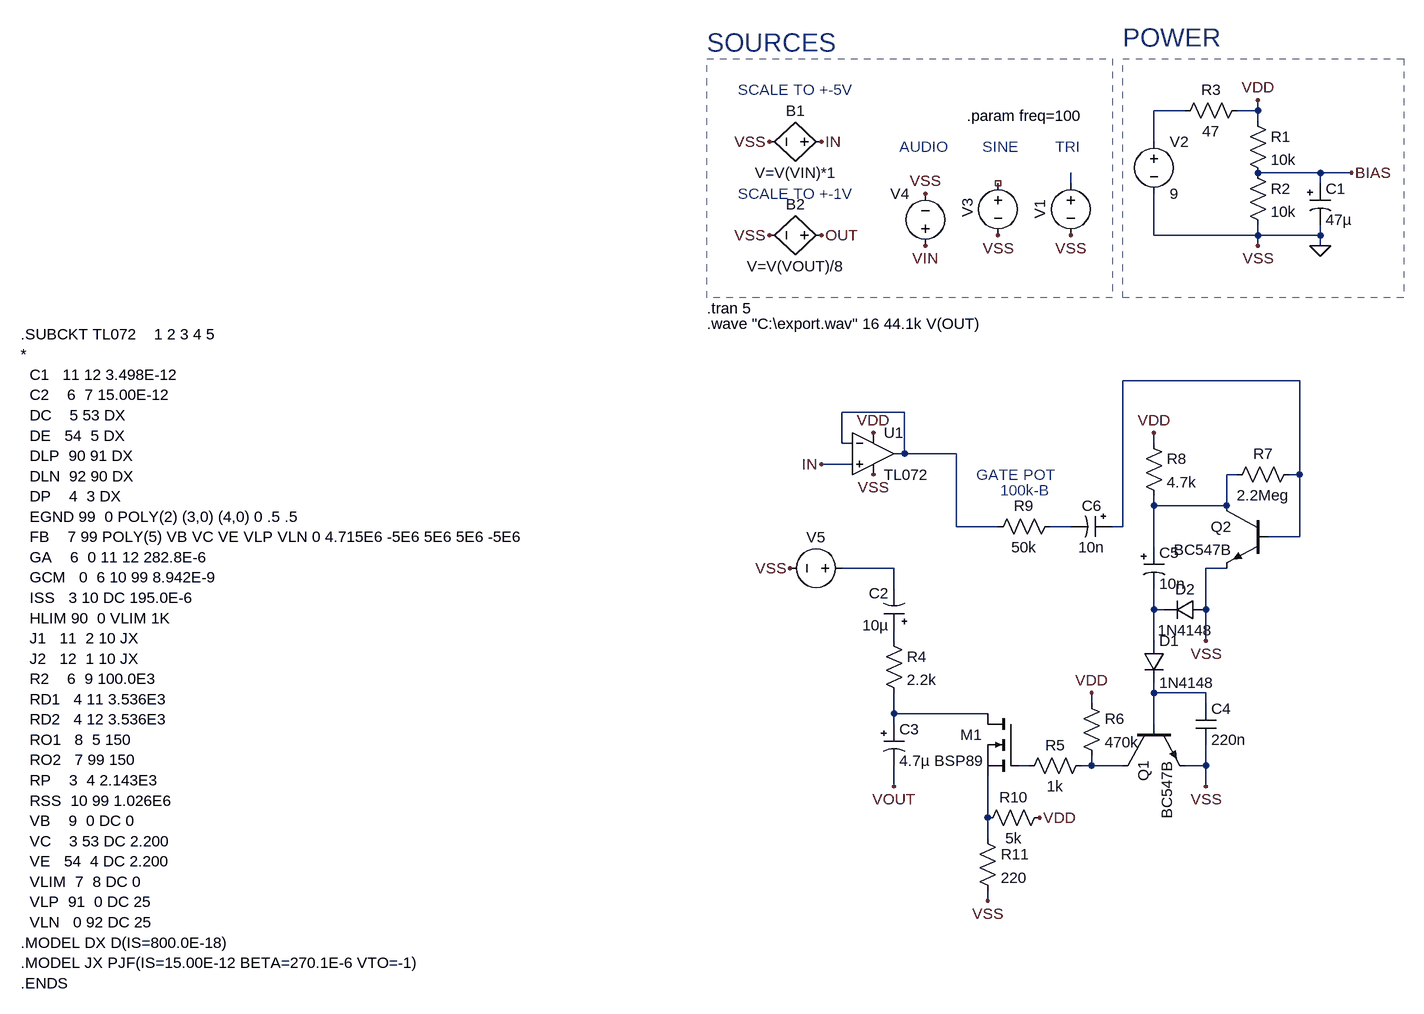
[diagram p0: schematic gate.asc]
gate.asc, the LTspice schematic file:
Version 4
SHEET 1 880 1276
WIRE 528 -32 480 -32
WIRE 640 -32 640 -48
WIRE 640 -32 608 -32
WIRE 640 -16 640 -32
WIRE 480 16 480 -32
WIRE 736 64 640 64
WIRE 784 64 736 64
WIRE 352 80 352 64
WIRE 736 80 736 64
WIRE 480 160 480 96
WIRE 640 160 640 144
WIRE 640 160 480 160
WIRE 736 160 736 144
WIRE 736 160 640 160
WIRE 640 176 640 160
WIRE 736 176 736 160
WIRE 704 384 432 384
WIRE 96 432 0 432
WIRE 0 480 0 432
WIRE 16 480 0 480
WIRE 480 480 480 464
WIRE 96 496 96 432
WIRE 96 496 80 496
WIRE 176 496 96 496
WIRE 16 512 -32 512
WIRE 608 528 592 528
WIRE 704 528 704 384
WIRE 704 528 688 528
WIRE 480 576 480 560
WIRE 592 576 592 528
WIRE 592 576 480 576
WIRE 176 608 176 496
WIRE 240 608 176 608
WIRE 352 608 320 608
WIRE 432 608 432 384
WIRE 432 608 416 608
WIRE 704 624 704 528
WIRE 704 624 656 624
WIRE 480 640 480 576
WIRE 80 672 0 672
WIRE 592 672 560 672
WIRE 80 704 80 672
WIRE 480 736 480 704
WIRE 496 736 480 736
WIRE 560 736 560 672
WIRE 80 784 80 768
WIRE 480 784 480 736
WIRE 560 784 560 736
WIRE 480 864 480 848
WIRE 560 864 480 864
WIRE 384 880 384 864
WIRE 560 880 560 864
WIRE 80 896 80 864
WIRE 224 896 80 896
WIRE 80 912 80 896
WIRE 480 912 480 864
WIRE 288 976 272 976
WIRE 384 976 384 960
WIRE 384 976 368 976
WIRE 432 976 384 976
WIRE 560 976 560 944
WIRE 560 976 528 976
WIRE 80 1008 80 976
WIRE 560 1008 560 976
WIRE 224 1056 224 992
WIRE 224 1088 224 1056
WIRE 224 1184 224 1168
FLAG 352 160 VSS
FLAG 784 64 BIAS
FLAG 640 176 VSS
FLAG 640 -48 VDD
FLAG 736 176 0
FLAG 240 160 VSS
FLAG 128 96 VSS
FLAG 128 176 VIN
FLAG -112 16 VSS
FLAG -32 16 IN
FLAG -112 160 VSS
FLAG -32 160 OUT
FLAG 80 1008 VOUT
FLAG 224 1184 VSS
FLAG 384 864 VDD
FLAG 560 1008 VSS
FLAG 560 784 VSS
FLAG 480 464 VDD
FLAG -32 512 IN
FLAG 48 464 VDD
FLAG 48 528 VSS
FLAG -80 672 VSS
FLAG 304 1056 VDD
SYMBOL voltage 352 64 R0
WINDOW 0 -32 56 VBottom 2
WINDOW 3 32 56 Invisible 2
WINDOW 123 0 0 Left 0
WINDOW 39 0 0 Left 0
SYMATTR InstName V1
SYMATTR Value PULSE(0 250m 0 {0.5/freq} {0.5/freq} 0 {1/freq})
SYMBOL voltage 480 0 R0
WINDOW 123 0 0 Left 0
WINDOW 39 0 0 Left 0
SYMATTR InstName V2
SYMATTR Value 9
SYMBOL res 624 -32 R0
SYMATTR InstName R1
SYMATTR Value 10k
SYMBOL res 624 48 R0
SYMATTR InstName R2
SYMATTR Value 10k
SYMBOL polcap 720 80 R0
SYMATTR InstName C1
SYMATTR Value 47µ
SYMBOL res 624 -48 R90
WINDOW 0 0 56 VBottom 2
WINDOW 3 32 56 VTop 2
SYMATTR InstName R3
SYMATTR Value 47
SYMBOL voltage 240 64 R0
WINDOW 0 -47 39 VRight 2
WINDOW 3 24 96 Invisible 2
WINDOW 123 0 0 Left 0
WINDOW 39 0 0 Left 0
SYMATTR InstName V3
SYMATTR Value SINE(0 1 {freq})
SYMBOL voltage 128 192 R180
WINDOW 0 24 96 Left 2
WINDOW 3 24 16 Invisible 2
SYMATTR InstName V4
SYMATTR Value wavefile="C:\input.wav" chan=0
SYMBOL bv -16 16 R90
WINDOW 0 -32 56 VBottom 2
WINDOW 3 32 56 VTop 2
SYMATTR InstName B1
SYMATTR Value V=V(VIN)*1
SYMBOL bv -16 160 R90
WINDOW 0 -32 56 VBottom 2
WINDOW 3 32 56 VTop 2
SYMATTR InstName B2
SYMATTR Value V=V(VOUT)/8
SYMBOL polcap 96 768 R180
WINDOW 0 24 57 Left 2
WINDOW 3 24 8 Left 2
SYMATTR InstName C2
SYMATTR Value 10µ
SYMBOL res 64 768 R0
SYMATTR InstName R4
SYMATTR Value 2.2k
SYMBOL nmos 272 896 M0
SYMATTR InstName M1
SYMATTR Value BSP89
SYMBOL res 368 864 R0
SYMATTR InstName R6
SYMATTR Value 470k
SYMBOL npn 432 912 M90
SYMATTR InstName Q1
SYMATTR Value BC547B
SYMBOL cap 544 880 R0
SYMATTR InstName C4
SYMATTR Value 220n
SYMBOL diode 464 784 R0
SYMATTR InstName D1
SYMATTR Value 1N4148
SYMBOL diode 560 720 R90
WINDOW 0 0 32 VBottom 2
WINDOW 3 32 32 VTop 2
SYMATTR InstName D2
SYMATTR Value 1N4148
SYMBOL polcap 464 640 R0
SYMATTR InstName C5
SYMATTR Value 10n
SYMBOL npn 656 576 M0
SYMATTR InstName Q2
SYMATTR Value BC547B
SYMBOL res 704 512 R90
WINDOW 0 0 56 VBottom 2
WINDOW 3 32 56 VTop 2
SYMATTR InstName R7
SYMATTR Value 2.2Meg
SYMBOL res 464 464 R0
SYMATTR InstName R8
SYMATTR Value 4.7k
SYMBOL polcap 416 592 R90
WINDOW 0 0 32 VBottom 2
WINDOW 3 32 32 VTop 2
SYMATTR InstName C6
SYMATTR Value 10n
SYMBOL res 336 592 R90
WINDOW 0 0 56 VBottom 2
WINDOW 3 32 56 VTop 2
SYMATTR InstName R9
SYMATTR Value 50k
SYMBOL OpAmps\\opamp2 48 432 R0
SYMATTR InstName U1
SYMATTR Value TL072
SYMBOL voltage 16 672 R90
WINDOW 0 -32 56 VBottom 2
WINDOW 3 32 56 Invisible 2
SYMATTR InstName V5
SYMATTR Value wavefile="C:\input2.wav" chan=0
SYMBOL polcap 64 912 R0
SYMATTR InstName C3
SYMATTR Value 4.7µ
SYMBOL res 384 960 R90
WINDOW 0 0 56 VBottom 2
WINDOW 3 32 56 VTop 2
SYMATTR InstName R5
SYMATTR Value 1k
SYMBOL res 320 1040 R90
WINDOW 0 0 56 VBottom 2
WINDOW 3 32 56 VTop 2
SYMATTR InstName R10
SYMATTR Value 5k
SYMBOL res 208 1072 R0
SYMATTR InstName R11
SYMATTR Value 220
TEXT 192 -24 Left 2 !.param freq=100
TEXT 216 24 Left 2 ;SINE
TEXT 328 24 Left 2 ;TRI
TEXT 88 24 Left 2 ;AUDIO
TEXT -208 -136 Left 4 ;SOURCES
TEXT 432 -144 Left 4 ;POWER
TEXT -160 -64 Left 2 ;SCALE TO +-5V
TEXT -160 96 Left 2 ;SCALE TO +-1V
TEXT -208 272 Left 2 !.tran 5
TEXT -208 296 Left 2 !.wave "C:\\export.wav" 16 44.1k V(OUT)
TEXT 328 528 Right 2 ;GATE POT
TEXT 320 552 Right 2 ;100k-B
TEXT -1264 312 Left 2 !.SUBCKT TL072    1 2 3 4 5\n*\n  C1   11 12 3.498E-12\n  C2    6  7 15.00E-12\n  DC    5 53 DX\n  DE   54  5 DX\n  DLP  90 91 DX\n  DLN  92 90 DX\n  DP    4  3 DX\n  EGND 99  0 POLY(2) (3,0) (4,0) 0 .5 .5\n  FB    7 99 POLY(5) VB VC VE VLP VLN 0 4.715E6 -5E6 5E6 5E6 -5E6\n  GA    6  0 11 12 282.8E-6\n  GCM   0  6 10 99 8.942E-9\n  ISS   3 10 DC 195.0E-6\n  HLIM 90  0 VLIM 1K\n  J1   11  2 10 JX\n  J2   12  1 10 JX\n  R2    6  9 100.0E3\n  RD1   4 11 3.536E3\n  RD2   4 12 3.536E3\n  RO1   8  5 150\n  RO2   7 99 150\n  RP    3  4 2.143E3\n  RSS  10 99 1.026E6\n  VB    9  0 DC 0\n  VC    3 53 DC 2.200\n  VE   54  4 DC 2.200\n  VLIM  7  8 DC 0\n  VLP  91  0 DC 25\n  VLN   0 92 DC 25\n.MODEL DX D(IS=800.0E-18)\n.MODEL JX PJF(IS=15.00E-12 BETA=270.1E-6 VTO=-1)\n.ENDS
RECTANGLE Normal 864 256 432 -112 1
RECTANGLE Normal 416 256 -208 -112 1

The netlist it stands for:
* gate.asc
V1 N002 0 PULSE(0 250m 0 {0.5/freq} {0.5/freq} 0 {1/freq})
V2 N001 0 9
R1 VDD BIAS 10k
R2 BIAS 0 10k
C1 BIAS 0 47µ
R3 VDD N001 47
V3 NC_01 0 SINE(0 1 {freq})
V4 VIN 0 wavefile="C:\input.wav" chan=0
B1 IN 0 V=V(VIN)*1
B2 OUT 0 V=V(VOUT)/8
C2 N009 N007 10µ
R4 N009 N011 2.2k
M1 N011 N012 N014 N014 BSP89
R6 VDD N013 470k
Q1 N013 N010 0 0 BC547B
C4 N010 0 220n
D1 N008 N010 1N4148
D2 0 N008 1N4148
C5 N005 N008 10n
Q2 N005 N003 0 0 BC547B
R7 N003 N005 2.2Meg
R8 VDD N005 4.7k
C6 N003 N006 10n
R9 N006 N004 50k
XU1 IN N004 VDD 0 N004 TL072  ; pins In+ In- V+ V- OUT
V5 N007 0 wavefile="C:\input2.wav" chan=0
C3 N011 VOUT 4.7µ
R5 N013 N012 1k
R10 VDD N014 5k
R11 N014 0 220
.model D D
.lib standard.dio
.model NPN NPN
.model PNP PNP
.lib standard.bjt
.model NMOS NMOS
.model PMOS PMOS
.lib standard.mos
.param freq=100
* SINE
* TRI
* AUDIO
* SOURCES
* POWER
* SCALE TO +-5V
* SCALE TO +-1V
.tran 5
.wave "C:\export.wav" 16 44.1k V(OUT)
* GATE POT
* 100k-B
.SUBCKT TL072    1 2 3 4 5
*
  C1   11 12 3.498E-12
  C2    6  7 15.00E-12
  DC    5 53 DX
  DE   54  5 DX
  DLP  90 91 DX
  DLN  92 90 DX
  DP    4  3 DX
  EGND 99  0 POLY(2) (3,0) (4,0) 0 .5 .5
  FB    7 99 POLY(5) VB VC VE VLP VLN 0 4.715E6 -5E6 5E6 5E6 -5E6
  GA    6  0 11 12 282.8E-6
  GCM   0  6 10 99 8.942E-9
  ISS   3 10 DC 195.0E-6
  HLIM 90  0 VLIM 1K
  J1   11  2 10 JX
  J2   12  1 10 JX
  R2    6  9 100.0E3
  RD1   4 11 3.536E3
  RD2   4 12 3.536E3
  RO1   8  5 150
  RO2   7 99 150
  RP    3  4 2.143E3
  RSS  10 99 1.026E6
  VB    9  0 DC 0
  VC    3 53 DC 2.200
  VE   54  4 DC 2.200
  VLIM  7  8 DC 0
  VLP  91  0 DC 25
  VLN   0 92 DC 25
.MODEL DX D(IS=800.0E-18)
.MODEL JX PJF(IS=15.00E-12 BETA=270.1E-6 VTO=-1)
.ENDS
.backanno
.end